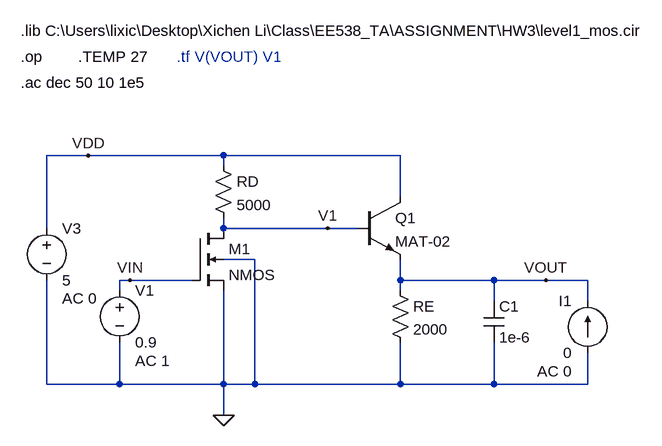
[diagram p0: schematic HW3.asc]
HW3.asc, the LTspice schematic file:
Version 4
SHEET 1 972 680
WIRE 16 32 -48 32
WIRE 224 32 16 32
WIRE 496 32 224 32
WIRE 224 48 224 32
WIRE 496 96 496 32
WIRE -48 144 -48 32
WIRE 224 144 224 128
WIRE 384 144 224 144
WIRE 432 144 384 144
WIRE 272 192 224 192
WIRE 80 224 64 224
WIRE 176 224 80 224
WIRE 496 224 496 192
WIRE 640 224 496 224
WIRE 720 224 640 224
WIRE 784 224 720 224
WIRE 64 240 64 224
WIRE 496 240 496 224
WIRE 640 256 640 224
WIRE 784 256 784 224
WIRE -48 384 -48 224
WIRE 64 384 64 320
WIRE 64 384 -48 384
WIRE 224 384 224 240
WIRE 224 384 64 384
WIRE 272 384 272 192
WIRE 272 384 224 384
WIRE 496 384 496 320
WIRE 496 384 272 384
WIRE 640 384 640 320
WIRE 640 384 496 384
WIRE 784 384 784 336
WIRE 784 384 640 384
WIRE 224 432 224 384
FLAG 224 432 0
FLAG 16 32 VDD
FLAG 384 144 V1
FLAG 720 224 VOUT
FLAG 80 224 VIN
DATAFLAG 144 224 ""
DATAFLAG 144 32 ""
DATAFLAG 336 144 ""
DATAFLAG 320 384 ""
SYMBOL voltage 64 224 R0
WINDOW 123 24 124 Left 2
WINDOW 39 0 0 Left 0
SYMATTR Value2 AC 1
SYMATTR InstName V1
SYMATTR Value 0.9
SYMBOL nmos4 176 144 R0
SYMATTR InstName M1
SYMATTR Value2 l=1u w=100u
SYMBOL voltage -48 128 R0
WINDOW 123 24 124 Left 2
WINDOW 39 0 0 Left 0
SYMATTR Value2 AC 0
SYMATTR InstName V3
SYMATTR Value 5
SYMBOL res 208 32 R0
SYMATTR InstName RD
SYMATTR Value 5000
SYMBOL npn 432 96 R0
SYMATTR InstName Q1
SYMATTR Value MAT-02
SYMBOL res 480 224 R0
SYMATTR InstName RE
SYMATTR Value 2000
SYMBOL cap 624 256 R0
SYMATTR InstName C1
SYMATTR Value 1e-6
SYMBOL current 784 336 R180
WINDOW 0 24 80 Left 2
WINDOW 3 24 0 Left 2
WINDOW 123 24 -28 Left 2
WINDOW 39 0 0 Left 0
SYMATTR InstName I1
SYMATTR Value 0
SYMATTR Value2 AC 0
TEXT -88 -160 Left 2 !.lib C:\\Users\\lixic\\Desktop\\Xichen Li\\Class\\EE538_TA\\ASSIGNMENT\\HW3\\level1_mos.cir
TEXT -88 -120 Left 2 !.op
TEXT 0 -120 Left 2 !.TEMP 27
TEXT 152 -120 Left 2 ;.tf V(VOUT) V1
TEXT -88 -80 Left 2 !.ac dec 50 10 1e5

The netlist it stands for:
* HW3.asc
V1 VIN 0 0.9 AC 1
M1 V1 VIN 0 0 NMOS l=1u w=100u
V3 VDD 0 5 AC 0
RD VDD V1 5000
Q1 VDD V1 VOUT 0 MAT-02
RE VOUT 0 2000
C1 VOUT 0 1e-6
I1 0 VOUT 0 AC 0
.model NPN NPN
.model PNP PNP
.lib standard.bjt
.model NMOS NMOS
.model PMOS PMOS
.lib standard.mos
.lib C:\Users\lixic\Desktop\Xichen Li\Class\EE538_TA\ASSIGNMENT\HW3\level1_mos.cir
.op
.TEMP 27
* .tf V(VOUT) V1
.ac dec 50 10 1e5
.backanno
.end